# Altium schematic sheet Sheet1.SchDoc
size 431 x 279 mm; SheetNumber: 1; SheetTotal: 1; ENG_APP_DATE: --/--/--; DSN_APP_DATE: --/--/--; CHK_APP_DATE: --/--/--
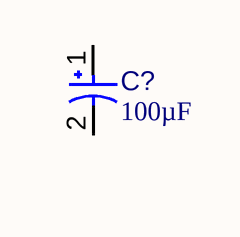
[diagram p0: Sheet1.SchDoc]

## Parts
C?  value 100µF  [CAPPR65-350-1150X800X1250]  (hidden comment: ECA1HM101)

## Nets

Not connected (* = marked no-connect by the designer): C? 1 2

## Notes on the sheet
- DWG. NO.
- REV.
- SHT.
- THIS DOCUMENT AND THE DATA DISCLOSED HEREIN OR HEREWITH IS THE PROPERTY OF ALTIUM LIMITED AND MAY BE FREELY DISTRIBUTED IN WHOLE. NO RIGHTS ARE RESERVED OR EXPRESS OR IMPLIED WARANTEE GIVEN.
- REVISION
- DESCRIPTION
- DATE
- APPROVED
- ENG:
- APPROVALS
- PROJECT
- DSN:
- CHK:
- REFERENCE DOCUMENTS
- PROJECT REVISION:
- TITLE
- DOCUMENT REVISION:
- DESIGN ITEM:
- BOM:
- FAB DWG:
- PCB DWG:
- ASSY DWG:
- SCALE:
- SIZE
- B
- CAGE CODE
- FILE NAME
- DWG NO.
- SHEET
- OF
- REV

## Library data of the parts
C? = CMP-001-00026-8: Aluminum Electrolytic Capacitor, 100 uF, +/- 20%, 50 V, -40 to 85 degC, 2-Pin THD, RoHS, Bulk; Manufacturer: Panasonic; Ripple Current: 250mA; Voltage Rating: 50V; Lead Pitch: 3.5mm; Pins: 2; Mounting Technology: TH; Datasheet Version: Rev. 05, 10/2016; Datasheet URL: https://industrial.panasonic.com/cdbs/www-data/pdf/RDF0000/ABA0000C1218.pdf; Min Operating Temperature: -40°C; Package Description: 2-Pin Radial Lead, Dia 8 mm, Height 12.5 mm; Ripple Current (AC): 250mA; Package Reference: CAPPR65-350-1150X800X1250; Manufacturer URL: http://www.panasonic.com/; RoHS Compliant: True; Packaging: Bulk; Tolerance: 20%; Case/Package: Radial; Diameter: 8mm; Capacitor Type: Electrolytic; Package Quantity: 200; Max Operating Temperature: 85°C